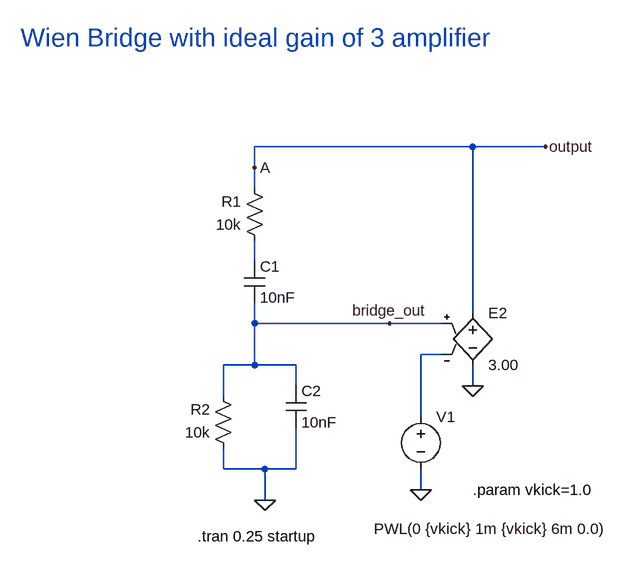
[diagram p0: schematic wien_bridge_vcvs_gain.asc]
wien_bridge_vcvs_gain.asc, the LTspice schematic file:
Version 4
SHEET 1 1136 792
WIRE 608 -80 272 -80
WIRE 720 -80 608 -80
WIRE 272 -48 272 -80
WIRE 272 -16 272 -48
WIRE 272 96 272 64
WIRE 608 176 608 -80
WIRE 272 192 272 160
WIRE 480 192 272 192
WIRE 560 192 480 192
WIRE 560 240 528 240
WIRE 272 256 272 192
WIRE 272 256 224 256
WIRE 336 256 272 256
WIRE 336 288 336 256
WIRE 608 288 608 256
WIRE 224 304 224 256
WIRE 528 336 528 240
WIRE 224 416 224 384
WIRE 288 416 224 416
WIRE 336 416 336 352
WIRE 336 416 288 416
WIRE 528 448 528 416
WIRE 288 464 288 416
FLAG 288 464 0
FLAG 272 -48 A
FLAG 608 288 0
FLAG 528 448 0
FLAG 480 192 bridge_out
FLAG 720 -80 output
SYMBOL res 288 80 R180
WINDOW 0 36 76 Left 2
WINDOW 3 36 40 Left 2
SYMATTR InstName R1
SYMATTR Value 10k
SYMBOL res 240 400 R180
WINDOW 0 36 76 Left 2
WINDOW 3 36 40 Left 2
SYMATTR InstName R2
SYMATTR Value 10k
SYMBOL cap 256 96 R0
SYMATTR InstName C1
SYMATTR Value 10nF
SYMBOL cap 320 288 R0
SYMATTR InstName C2
SYMATTR Value 10nF
SYMBOL e 608 160 R0
SYMATTR InstName E2
SYMATTR Value 3.00
SYMBOL voltage 528 320 R0
WINDOW 3 -72 188 Left 2
WINDOW 123 0 0 Left 0
WINDOW 39 0 0 Left 0
SYMATTR Value PWL(0 {vkick} 1m {vkick} 6m 0.0)
SYMATTR InstName V1
TEXT 184 520 Left 2 !.tran 0.25 startup
TEXT -88 -248 Left 4 ;Wien Bridge with ideal gain of 3 amplifier
TEXT 608 448 Left 2 !.param vkick=1.0

The netlist it stands for:
* wien_bridge_vcvs_gain.asc
R1 N001 output 10k
R2 0 bridge_out 10k
C1 N001 bridge_out 10nF
C2 bridge_out 0 10nF
E2 output 0 bridge_out N002 3.00
V1 N002 0 PWL(0 {vkick} 1m {vkick} 6m 0.0)
.tran 0.25 startup
* Wien Bridge with ideal gain of 3 amplifier
.param vkick=1.0
.backanno
.end